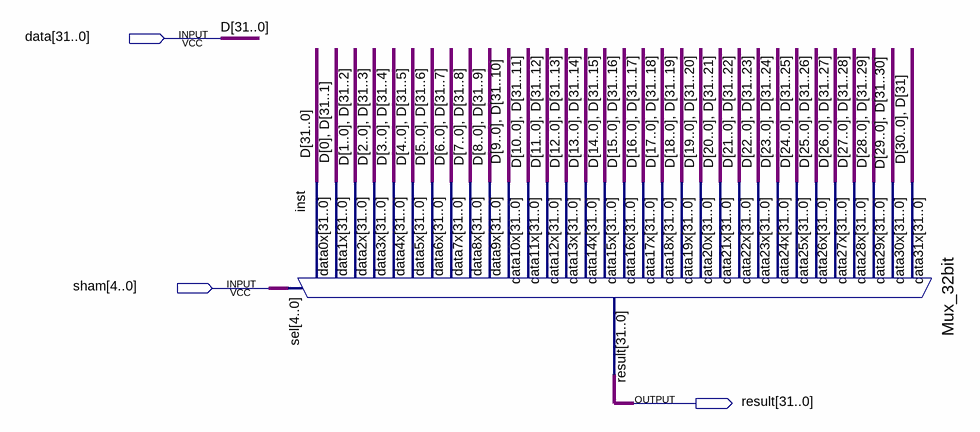
[diagram p0: schematic sheet]
// Quartus schematic rrot.bdf as structural Verilog: 1 symbols, 3 pins
module rrot (
  input  [31:0] data,
  input  [4:0] sham,
  output [31:0] result
);

  Mux_32bit inst (
    .data31x({data[30:0], data[31]}), .data30x({data[29:0], data[31:30]}),
    .data29x({data[28:0], data[31:29]}), .data28x({data[27:0], data[31:28]}),
    .data27x({data[26:0], data[31:27]}), .data26x({data[25:0], data[31:26]}),
    .data25x({data[24:0], data[31:25]}), .data24x({data[23:0], data[31:24]}),
    .data23x({data[22:0], data[31:23]}), .data22x({data[21:0], data[31:22]}),
    .data21x({data[20:0], data[31:21]}), .data20x({data[19:0], data[31:20]}),
    .data19x({data[18:0], data[31:19]}), .data18x({data[17:0], data[31:18]}),
    .data17x({data[16:0], data[31:17]}), .data16x({data[15:0], data[31:16]}),
    .data15x({data[14:0], data[31:15]}), .data14x({data[13:0], data[31:14]}),
    .data13x({data[12:0], data[31:13]}), .data12x({data[11:0], data[31:12]}),
    .data11x({data[10:0], data[31:11]}), .data10x({data[9:0], data[31:10]}),
    .data9x({data[8:0], data[31:9]}), .data8x({data[7:0], data[31:8]}), .data7x({data[6:0], data[31:7]}),
    .data6x({data[5:0], data[31:6]}), .data5x({data[4:0], data[31:5]}), .data4x({data[3:0], data[31:4]}),
    .data3x({data[2:0], data[31:3]}), .data2x({data[1:0], data[31:2]}), .data1x({data[0], data[31:1]}),
    .data0x(data), .sel(sham), .result(result));

  // Other names for the same wires on the sheet: D[31:0] = data
endmodule
